# Altium project LPCB282__RLOOP__MA860H_IF.PrjPCB
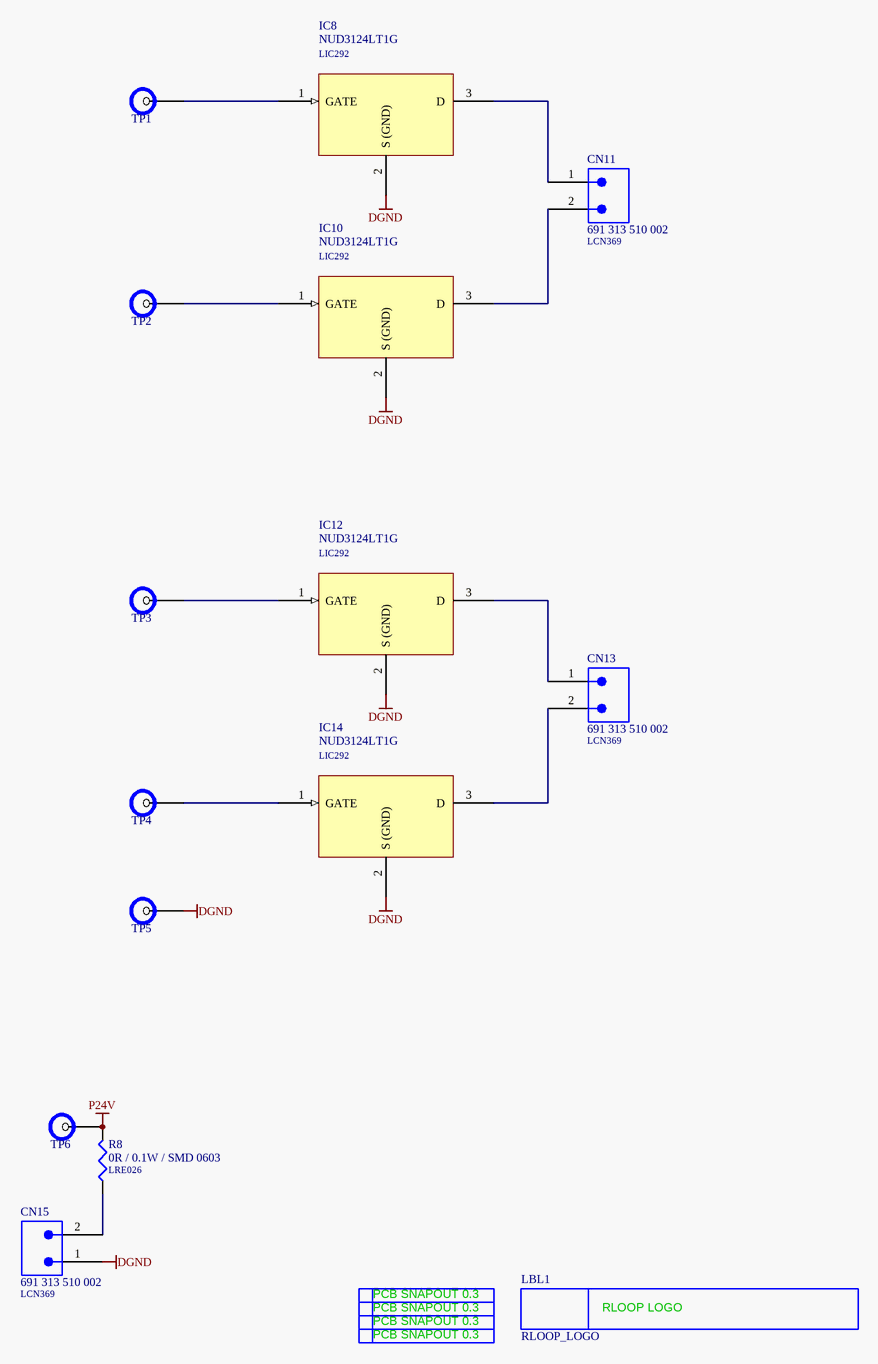
[diagram p0: LPCB282 - TOP.SchDoc]
1 sheet, 19 parts. Net scope: global (net labels, ports and power ports of the same name join across sheets).
Board file: LPCB282R0.PcbDoc

## Sheet LPCB282 - TOP.SchDoc
size A3; Address1: Factory 10; Address2: 9-13 Dingley Avenue, Dandeong, VICTORIA 3175, AUSTRALIA; DocumentNumber: 1; Revision: 1; SheetNumber: 1; SheetTotal: 1; Lockie__PCB_SUB_ASSEMBLY: PCB Sub Component; Lockie__PCB_ASSEMBLY: PCB Assembly; Lockie__LDL: LPCB282; Lockie__PCB_DESCRIPTION: MH680H Interface

### Parts
CN11  691 313 510 002  LDL_NUMBER: LCN369  [691 313 510 002]
CN13  691 313 510 002  LDL_NUMBER: LCN369  [691 313 510 002]
CN15  691 313 510 002  LDL_NUMBER: LCN369  [691 313 510 002]
IC8  NUD3124LT1G  LDL_NUMBER: LIC292  [LFP021__SOT23]
IC10  NUD3124LT1G  LDL_NUMBER: LIC292  [LFP021__SOT23]
IC12  NUD3124LT1G  LDL_NUMBER: LIC292  [LFP021__SOT23]
IC14  NUD3124LT1G  LDL_NUMBER: LIC292  [LFP021__SOT23]
LBL1  RLOOP_LOGO  [RLOOP_LOGO]  (no BOM)
R8  0R / 0.1W / SMD 0603  LDL_NUMBER: LRE026  [LFP020__CR1608-0603-IPC7351_B]
SN1  PCB_SNAPOUT_0.3MM  [PCB_SNAPOUT_0.3MM]  (value not drawn)  (no BOM)
SN2  PCB_SNAPOUT_0.3MM  [PCB_SNAPOUT_0.3MM]  (value not drawn)  (no BOM)
SN3  PCB_SNAPOUT_0.3MM  [PCB_SNAPOUT_0.3MM]  (value not drawn)  (no BOM)
SN4  PCB_SNAPOUT_0.3MM  [PCB_SNAPOUT_0.3MM]  (value not drawn)  (no BOM)
TP1  SMD_TP_VIA  [SMD-TP-VIA]  (value not drawn)  (no BOM)
TP2  SMD_TP_VIA  [SMD-TP-VIA]  (value not drawn)  (no BOM)
TP3  SMD_TP_VIA  [SMD-TP-VIA]  (value not drawn)  (no BOM)
TP4  SMD_TP_VIA  [SMD-TP-VIA]  (value not drawn)  (no BOM)
TP5  SMD_TP_VIA  [SMD-TP-VIA]  (value not drawn)  (no BOM)
TP6  SMD_TP_VIA  [SMD-TP-VIA]  (value not drawn)  (no BOM)

### Nets
DGND: CN15.1 IC8.2(S_(GND)) IC10.2(S_(GND)) IC12.2(S_(GND)) IC14.2(S_(GND)) TP5.1
P24V: R8.2 TP6.1
NetCN11_1: CN11.1 IC8.3(D)
NetCN11_2: CN11.2 IC10.3(D)
NetCN13_1: CN13.1 IC12.3(D)
NetCN13_2: CN13.2 IC14.3(D)
NetCN15_2: CN15.2 R8.1
NetIC8_1: IC8.1(GATE) TP1.1
NetIC10_1: IC10.1(GATE) TP2.1
NetIC12_1: IC12.1(GATE) TP3.1
NetIC14_1: IC14.1(GATE) TP4.1

### Notes on the sheet
- PCB COMPONENT DESCRIPTION
- LDL NUMBER
- Assembly Details
- Size
- Drawing File Name
- Revision
- http://sil3.com.au
  ACN: 123 529 064
  Factory 10
  9-13 Dingley Avenue
  Dandenong, VICTORIA
  Australia
- Scale
- A3
- Sheet Details
- N.T.S
- Sheet:
- Of:
- (in symbol PCB_SNAPOUT_0.3MM) PCB SNAPOUT 0.3
- (in symbol RLOOP_LOGO) RLOOP LOGO

### Library data of the parts
CN11 CN13 CN15 = 691 313 510 002: Connector, Pluggable Terminal Block, 5.08mm, 2 Way, PTH; FMEDA__CHANNEL: COM; FMEDA__OPERATING__CURRENT_MAX: 0; FMEDA__OPERATING__TEMP_MAX: 50; FMEDA__OPERATING__TEMP_MIN: -20; FMEDA__OPERATING__TEMP_TYP: 27; FMEDA__OPERATING__VOLTAGE_MAX: 16; FMEDA__OPERATING__VOLTAGE_TYP: 12; FMEDA__FUNCTION_IN_SYSTEM: *; FMEDA__OPERATING__CURRENT_MIN: 0; FMEDA__OPERATING__CURRENT_TYP: 0; FMEDA__OPERATING__VOLTAGE_MIN: 0
IC8 IC10 IC12 IC14 = NUD3124LT1G: IC, Relay Driver, 28V Industrial, SMD SOT23 [LIC292]; FMEDA__OPERATING__TEMP_MIN: -20; FMEDA__OPERATING__TEMP_TYP: 27; FMEDA__OPERATING__TEMP_MAX: 50; FMEDA__OPERATING__VOLTAGE_MIN: 0; FMEDA__OPERATING__VOLTAGE_TYP: 13; FMEDA__OPERATING__VOLTAGE_MAX: 18; FMEDA__OPERATING__POWER_TYP: 0.1; FMEDA__OPERATING__POWER_MAX: 0.15; FMEDA__CHANNEL: COM; FMEDA__FUNCTION_IN_SYSTEM: *; FMEDA__OPERATING__POWER_MIN: 0
LBL1 = RLOOP_LOGO: FMEDA__CHANNEL: DIAG; FMEDA__FUNCTION_IN_SYSTEM: *
R8 = 0R / 0.1W / SMD 0603: Resistor, Ceramic Chip, 0R, 0.1W, SMD 0603 [LRE026]; Value: 0; FMEDA__OPERATING__TEMP_MAX: 50; FMEDA__OPERATING__TEMP_MIN: -20; FMEDA__OPERATING__TEMP_TYP: 27; FMEDA__CHANNEL: COM; FMEDA__OPERATING__POWER_MAX: 0; FMEDA__OPERATING__POWER_MIN: 0; FMEDA__OPERATING__VOLTAGE_MAX: 0; FMEDA__OPERATING__VOLTAGE_MIN: 0; FMEDA__OPERATING__VOLTAGE_TYP: 0; FMEDA__FUNCTION_IN_SYSTEM: *
SN1-SN4 = PCB_SNAPOUT_0.3MM: PCB Snapout + 0.3mm; FMEDA__CHANNEL: DIAG; FMEDA__FUNCTION_IN_SYSTEM: *
TP1-TP6 = SMD_TP_VIA: SMD Test Point With VIA; FMEDA__CHANNEL: COM; FMEDA__OPERATING__CURRENT_MAX: 0; FMEDA__OPERATING__TEMP_MAX: 50; FMEDA__OPERATING__TEMP_MIN: -20; FMEDA__OPERATING__TEMP_TYP: 27; FMEDA__OPERATING__VOLTAGE_MAX: 16; FMEDA__OPERATING__VOLTAGE_TYP: 12; FMEDA__FUNCTION_IN_SYSTEM: *; FMEDA__OPERATING__CURRENT_MIN: 0; FMEDA__OPERATING__CURRENT_TYP: 0; FMEDA__OPERATING__VOLTAGE_MIN: 0